# EAGLE design programmer-shield (EAGLE 6.4)
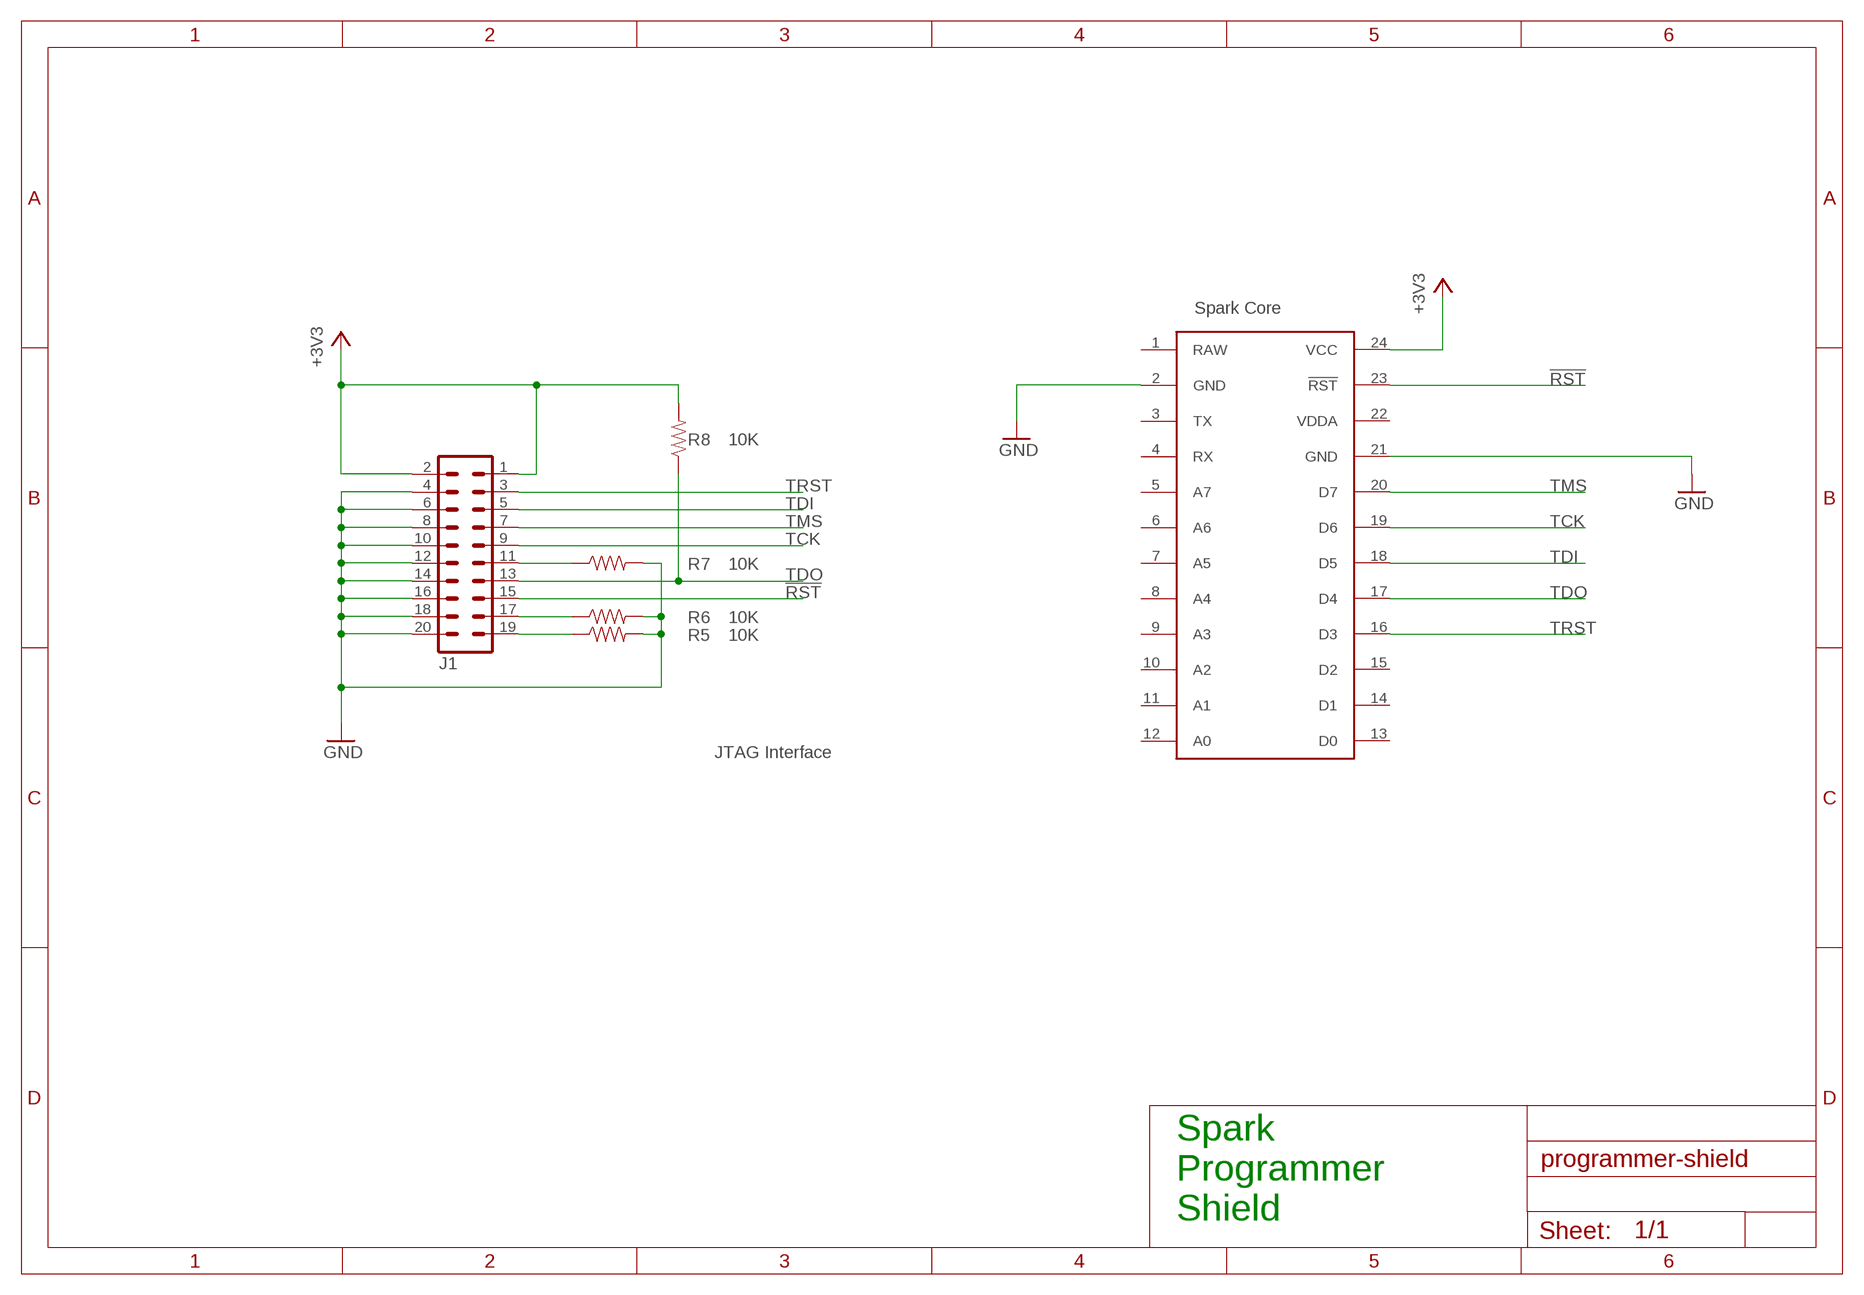
[diagram p0: schematic, sheet 1]

## Parts
J1  ML20  [ML20]
R5  10K  RESISTORAXIAL-0.3  [AXIAL-0.3]
R6  10K  RESISTORAXIAL-0.3  [AXIAL-0.3]
R7  10K  RESISTORAXIAL-0.3  [AXIAL-0.3]
R8  10K  RESISTORAXIAL-0.3  [AXIAL-0.3]
U$1  SPARK_CORECORE  [SPARK_CORE]

## Nets
!RST: J1.15 U$1.23(!RST)
+3V3: J1.1 J1.2 R8.P$2 U$1.24(VCC)
GND: J1.4 J1.6 J1.8 J1.10 J1.12 J1.14 J1.16 J1.18 J1.20 R5.P$2 R6.P$2 R7.P$2 U$1.2(GND) U$1.21(GND)
N$13: J1.19 R5.P$1
N$14: J1.17 R6.P$1
N$15: J1.11 R7.P$1
TCK: J1.9 U$1.19(D6)
TDI: J1.5 U$1.18(D5)
TDO: J1.13 R8.P$1 U$1.17(D4)
TMS: J1.7 U$1.20(D7)
TRST: J1.3 U$1.16(D3)
Unconnected: U$1.3(TX) U$1.4(RX) U$1.5(A7) U$1.6(A6) U$1.7(A5) U$1.8(A4) U$1.9(A3) U$1.10(A2) U$1.11(A1) U$1.12(A0) U$1.13(D0) U$1.14(D1) U$1.15(D2)

## Notes on the sheet
- Spark Core
- JTAG Interface
- Spark
  Programmer
  Shield

## Power pins joined to a net without a drawn wire
RAW: U$1.1(RAW)
VDDA: U$1.22(VDDA)

## Library data of the parts
J1 = con-harting-ml:ML20: HARTING
R5-R8 = SparkFun-Passives:RESISTOR: Resistor Basic schematic elements and footprints for 0603, 1206, and PTH resistors.
U$1 = Spark:SPARK_CORE

## Board
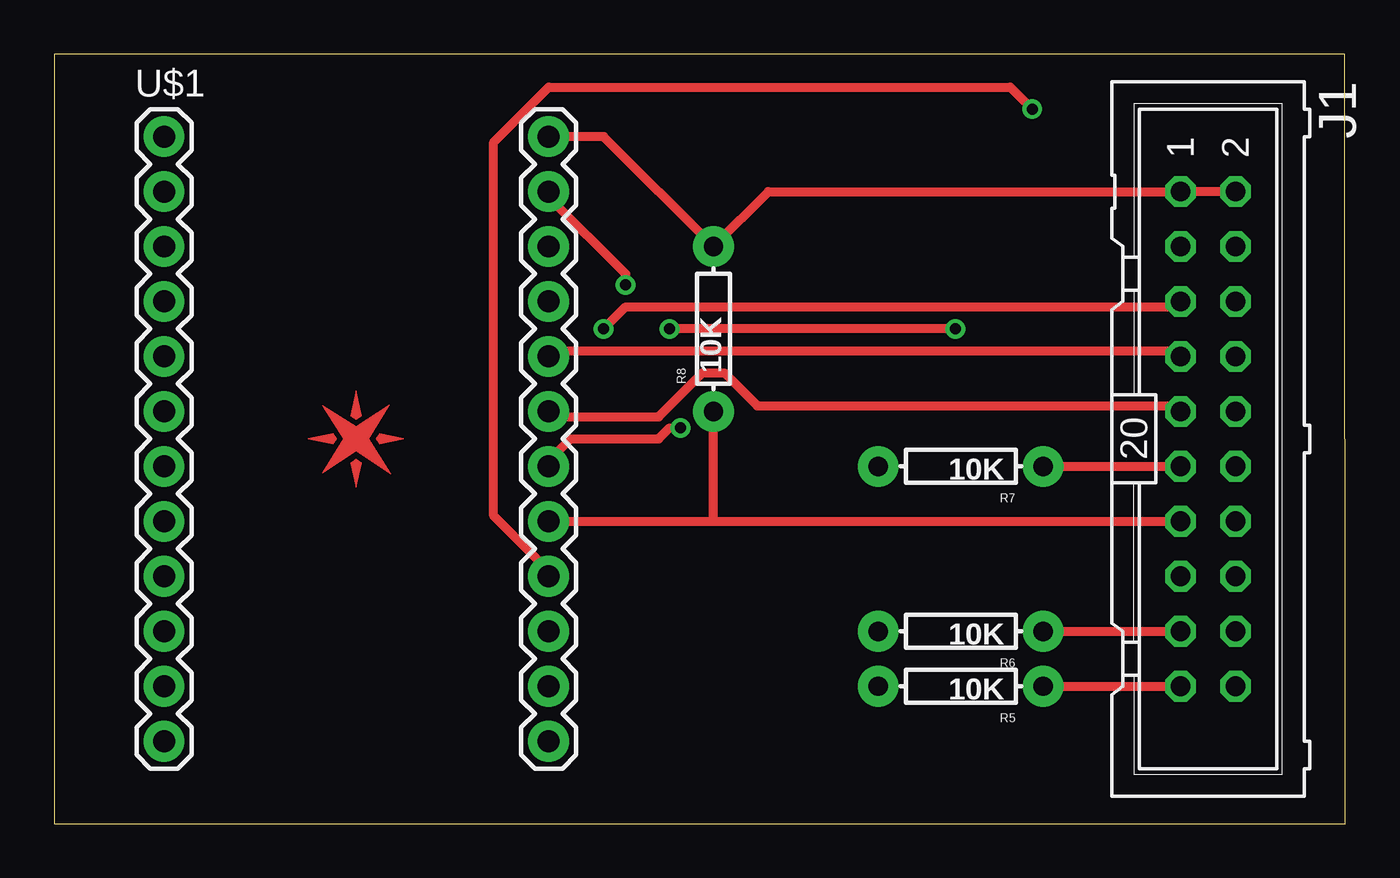
[diagram p1: board, top side]
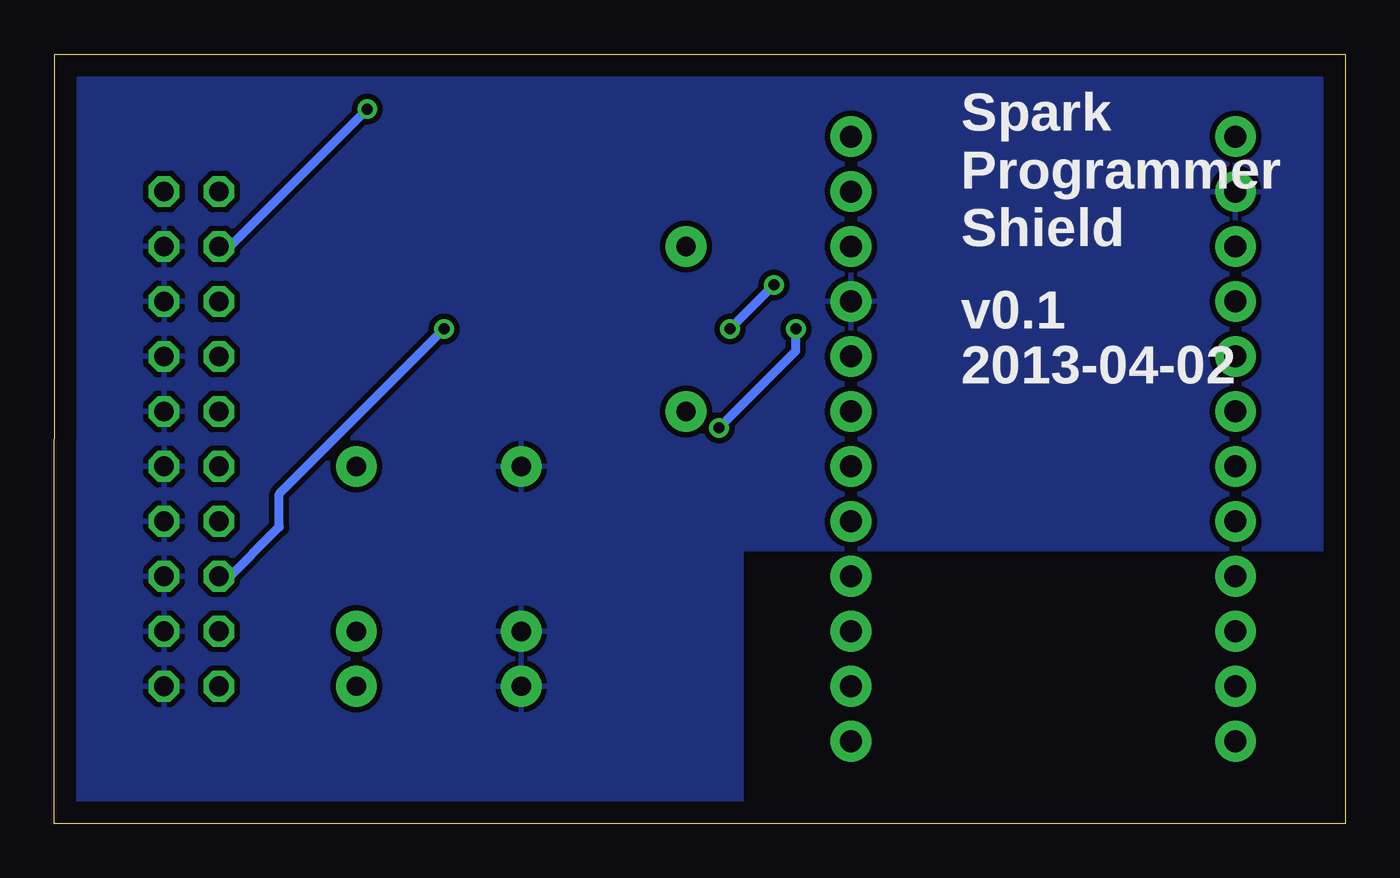
[diagram p2: board, bottom side, seen from below]

Size 59.69 x 35.56 mm. Coordinates in mm from the lower left corner, seen from the top.
Outline: 0,0 59.69,0 59.67,35.56 0,35.56 0,0
Copper layers (1*16): Top 0.035mm / dielectric 1.5mm / Bottom 0.035mm
Design rules "default *": minimum track width 10mil, minimum drill 0.3mm, track to track 10mil, track to pad 10mil, pad to pad 10mil, via to via 10mil, smd to smd 10mil, copper to edge 40mil, drill to drill 8mil, minimum pad ring 10mil, minimum via ring 8mil, stop-mask expansion 4mil, vias tented up to drill 0mil, thermal gap 10mil

### Footprints (pad centres in the part's own frame; a part is rotated, then mirrored left to right if it is on the bottom)
ML20 = drill 0.914 octagon: 1 -11.43,-1.27; 2 -11.43,1.27; 3 -8.89,-1.27; 4 -8.89,1.27; 5 -6.35,-1.27; 6 -6.35,1.27; 7 -3.81,-1.27; 8 -3.81,1.27; 9 -1.27,-1.27; 10 -1.27,1.27; 11 1.27,-1.27; 12 1.27,1.27; 13 3.81,-1.27; 14 3.81,1.27; 15 6.35,-1.27; 16 6.35,1.27; 17 8.89,-1.27; 18 8.89,1.27; 19 11.43,-1.27; 20 11.43,1.27
AXIAL-0.3 = drill 0.9 pad 1.88: P$1 -3.81,0; P$2 3.81,0
SPARK_CORE = drill 1.016 pad 1.88: 1 -8.89,13.97; 2 -8.89,11.43; 3 -8.89,8.89; 4 -8.89,6.35; 5 -8.89,3.81; 6 -8.89,1.27; 7 -8.89,-1.27; 8 -8.89,-3.81; 9 -8.89,-6.35; 10 -8.89,-8.89; 11 -8.89,-11.43; 12 -8.89,-13.97; 13 8.89,-13.97; 14 8.89,-11.43; 15 8.89,-8.89; 16 8.89,-6.35; 17 8.89,-3.81; 18 8.89,-1.27; 19 8.89,1.27; 20 8.89,3.81; 21 8.89,6.35; 22 8.89,8.89; 23 8.89,11.43; 24 8.89,13.97

### Placement (x,y rotation side)
E$1  [SPARK_LOGO_PLUS_PLANE]  13.97,17.78 0 top
J1  53.34,17.78 270 top
R5  41.91,6.35 180 top
R6  41.91,8.89 180 top
R7  41.91,16.51 180 top
R8  30.48,22.86 90 top
U$1  13.97,17.78 0 top

### Tracks (layer width: path | path; a pad name or v marks a point on that pad's centre or on a via)
!RST  (via drill 0.51)
  Top 0.406: v26.42,24.89 26.42,25.4 22.86,28.96 U$1.23 | v41.66,22.86 v28.45,22.86
  Bottom 0.406: v28.45,22.86 v26.42,24.89 | v41.66,22.86 49.28,15.24 49.28,13.72 51.82,11.18 J1.15
+3V3
  Top 0.406: J1.2 J1.1 33.02,29.21 R8.P$2 25.4,31.75 U$1.24
GND
  pour Bottom: 0,35.56 0,12.7 27.94,12.7 27.94,0 59.69,0 59.69,35.56
N$13
  Top 0.406: R5.P$1 J1.19
N$14
  Top 0.406: R6.P$1 J1.17
N$15
  Top 0.406: R7.P$1 J1.11
TCK
  Top 0.406: J1.9 51.82,19.3 32.51,19.3 30.99,20.83 29.97,20.83 27.94,18.8 22.86,18.8 U$1.19
TDI  (via drill 0.51)
  Top 0.406: v25.4,22.86 26.42,23.88 51.82,23.88 J1.5 | v28.96,18.29 28.45,18.29 27.94,17.78 23.88,17.78 22.86,16.76 U$1.18
  Bottom 0.406: v25.4,22.86 25.4,21.84 v28.96,18.29
TDO
  Top 0.406: U$1.17 30.48,13.97 | 30.48,13.97 J1.13 | 30.48,13.97 R8.P$1
TMS
  Top 0.406: J1.7 51.82,21.84 22.86,21.84 U$1.20
TRST  (via drill 0.51)
  Top 0.406: v45.21,33.02 44.2,34.04 22.86,34.04 20.32,31.5 20.32,14.22 22.86,11.68 U$1.16
  Bottom 0.406: v45.21,33.02 51.82,26.42 J1.3

### Text on the board
bPlace: Spark / Programmer / Shield | v0.1 | 2013-04-02